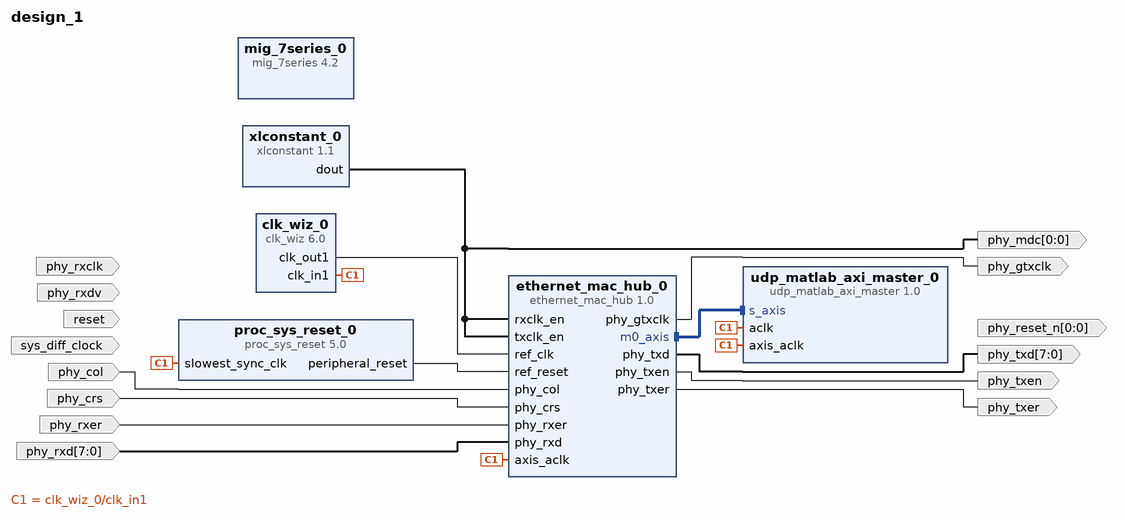
[diagram p0: block diagram of the top level]
# Vivado block design design_1, xc7a100tcsg324-1, Vivado 2019.1
create_bd_design design_1

create_bd_port -dir I -type data sys_diff_clock
create_bd_port -dir I -type data reset
create_bd_port -dir I -type data phy_col
create_bd_port -dir I -type data phy_crs
create_bd_port -dir I -type data phy_rxclk
create_bd_port -dir I -type data phy_rxdv
create_bd_port -dir I -from 7 -to 0 -type data phy_rxd
create_bd_port -dir O -from 0 -to 0 -type data phy_reset_n
create_bd_port -dir O -type data phy_gtxclk
create_bd_port -dir O -type data phy_txen
create_bd_port -dir O -type data phy_txer
create_bd_port -dir O -from 0 -to 0 -type data phy_mdc
create_bd_port -dir O -from 7 -to 0 -type data phy_txd
create_bd_port -dir I -type data phy_rxer

create_bd_cell -type ip -vlnv xilinx.com:ip:clk_wiz:6.0 clk_wiz_0
set_property -dict [list \
  CONFIG.ENABLE_CLOCK_MONITOR false \
  CONFIG.PRIMITIVE MMCM \
  CONFIG.USE_LOCKED false \
  CONFIG.USE_RESET false \
] [get_bd_cells clk_wiz_0]
create_bd_cell -type ip -vlnv xilinx.com:ip:xlconstant:1.1 xlconstant_0
create_bd_cell -type ip -vlnv mathworks.com:ip:ethernet_mac_hub:1.0 ethernet_mac_hub_0
create_bd_cell -type ip -vlnv mathworks.com:ip:udp_matlab_axi_master:1.0 udp_matlab_axi_master_0
create_bd_cell -type ip -vlnv xilinx.com:ip:proc_sys_reset:5.0 proc_sys_reset_0
create_bd_cell -type ip -vlnv xilinx.com:ip:mig_7series:4.2 mig_7series_0

# ---- connections ----

connect_bd_intf_net [get_bd_intf_pins ethernet_mac_hub_0/m0_axis] [get_bd_intf_pins udp_matlab_axi_master_0/s_axis]
connect_bd_net [get_bd_pins xlconstant_0/dout] \
  [get_bd_pins ethernet_mac_hub_0/rxclk_en] [get_bd_pins ethernet_mac_hub_0/txclk_en] [get_bd_ports phy_mdc]
connect_bd_net [get_bd_pins clk_wiz_0/clk_out1] [get_bd_pins ethernet_mac_hub_0/ref_clk]
connect_bd_net [get_bd_ports phy_col] [get_bd_pins ethernet_mac_hub_0/phy_col]
connect_bd_net [get_bd_ports phy_crs] [get_bd_pins ethernet_mac_hub_0/phy_crs]
connect_bd_net [get_bd_ports phy_rxer] [get_bd_pins ethernet_mac_hub_0/phy_rxer]
connect_bd_net [get_bd_pins ethernet_mac_hub_0/phy_txd] [get_bd_ports phy_txd]
connect_bd_net [get_bd_pins ethernet_mac_hub_0/phy_gtxclk] [get_bd_ports phy_gtxclk]
connect_bd_net [get_bd_pins ethernet_mac_hub_0/phy_txen] [get_bd_ports phy_txen]
connect_bd_net [get_bd_pins ethernet_mac_hub_0/phy_txer] [get_bd_ports phy_txer]
connect_bd_net [get_bd_pins proc_sys_reset_0/peripheral_reset] [get_bd_pins ethernet_mac_hub_0/ref_reset]
connect_bd_net [get_bd_ports phy_rxd] [get_bd_pins ethernet_mac_hub_0/phy_rxd]
connect_bd_net [get_bd_pins clk_wiz_0/clk_in1] \
  [get_bd_pins proc_sys_reset_0/slowest_sync_clk] [get_bd_pins udp_matlab_axi_master_0/axis_aclk] \
  [get_bd_pins udp_matlab_axi_master_0/aclk] [get_bd_pins ethernet_mac_hub_0/axis_aclk]

validate_bd_design
save_bd_design
